# EAGLE design xmega breakout (EAGLE 7.1.0)
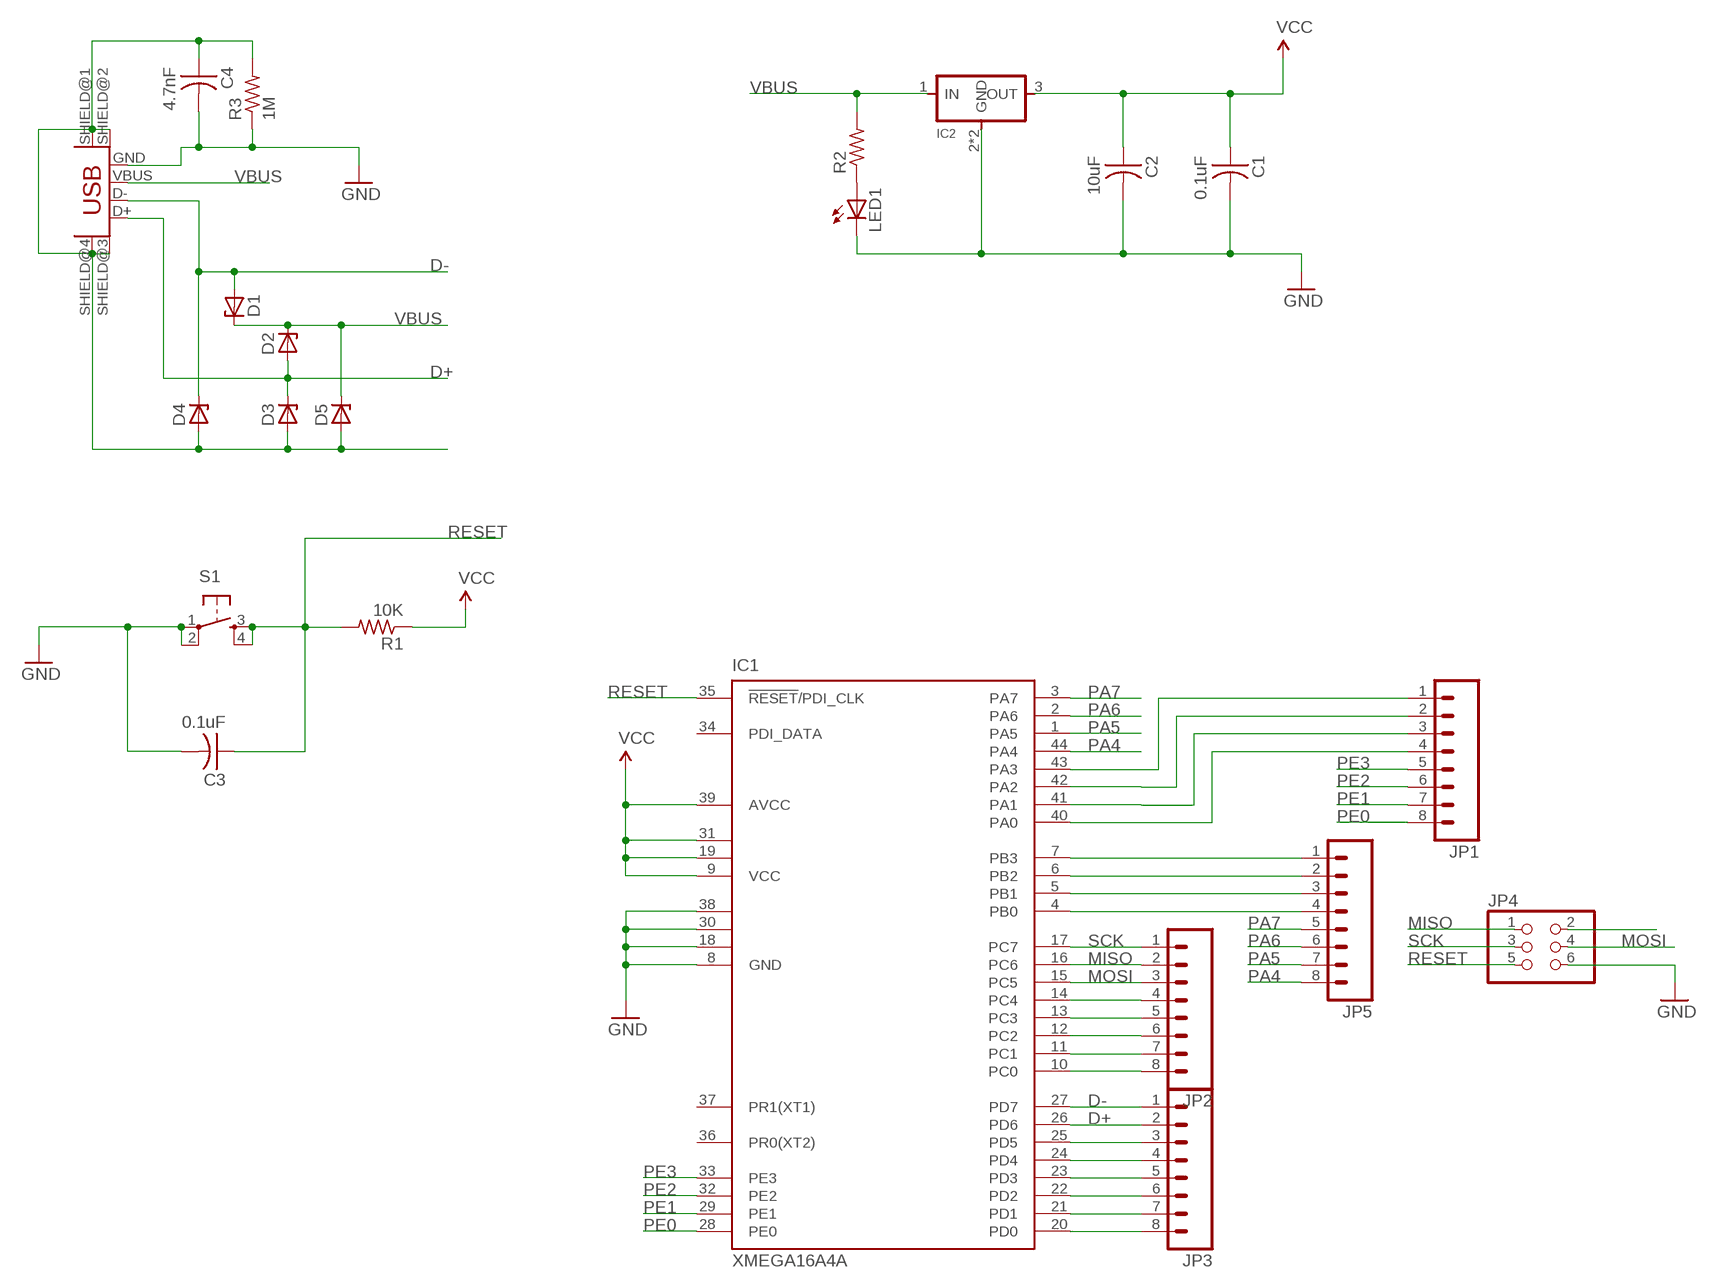
[diagram p0: schematic, sheet 1]

## Parts
C1  0.1uF  CAP-US1206  [C1206]
C2  10uF  CAP-US1206  [C1206]
C3  0.1uF  CAP-US1206  [C1206]
C4  4.7nF  CAP-US1206  [C1206]
D1  ZENER_DIODESOD123  [SOD123]
D2  ZENER_DIODESOD123  [SOD123]
D3  ZENER_DIODESOD123  [SOD123]
D4  ZENER_DIODESOD123  [SOD123]
D5  ZENER_DIODESOD123  [SOD123]
IC1  XMEGA16A4A  [TQFP44]
IC2  REGULATORSOT223  [SOT223]
JP1  M08  [1X08_SMD_ALT_2X1X4]
JP2  M08SMD-STRAIGHT-ALT  [1X08_SMD_ALT]
JP3  M08SMD-STRAIGHT-ALT  [1X08_SMD_ALT]
JP4  PINHD-2X3-SMD  [2X03SMD]
JP5  M08SMD-STRAIGHT-ALT  [1X08_SMD_ALT]
LED1  LEDSMT1206  [1206]
R1  10K  RES-US1206FAB  [R1206FAB]
R2  RES-US1206FAB  [R1206FAB]
R3  1M  RES-US1206FAB  [R1206FAB]
S1  6MM_SWITCH6MM_SWITCH  [6MM_SWITCH]
U$1  USB_MINIB  [USB_MINIB]

## Nets
D+: D2.ANODE D3.CATHODE IC1.26(PD6) JP3.2 U$1.D+
D-: D1.ANODE D4.CATHODE IC1.27(PD7) JP3.1 U$1.D-
GND: C1.2 C2.2 C3.2 C4.2 IC1.8(GND) IC1.18(GND1) IC1.30(GND2) IC1.38(GND3) IC2.2(GND) IC2.4(GND) JP4.6 LED1.C R3.1 S1.1(P) S1.2(P1) U$1.GND
MISO: IC1.16(PC6) JP2.2 JP4.1
MOSI: IC1.15(PC5) JP2.3 JP4.4
N$5: IC1.43(PA3) JP1.1
N$6: IC1.42(PA2) JP1.2
N$7: IC1.41(PA1) JP1.3
N$8: IC1.40(PA0) JP1.4
N$9: IC1.7(PB3) JP5.1
N$10: IC1.6(PB2) JP5.2
N$11: IC1.5(PB1) JP5.3
N$12: IC1.14(PC4) JP2.4
N$13: IC1.13(PC3) JP2.5
N$14: IC1.12(PC2) JP2.6
N$15: IC1.11(PC1) JP2.7
N$16: IC1.10(PC0) JP2.8
N$17: JP4.2
N$18: IC1.4(PB0) JP5.4
N$19: IC1.25(PD5) JP3.3
N$20: IC1.24(PD4) JP3.4
N$21: IC1.23(PD3) JP3.5
N$22: IC1.22(PD2) JP3.6
N$23: IC1.21(PD1) JP3.7
N$24: IC1.20(PD0) JP3.8
N$25: C4.1 D3.ANODE D4.ANODE D5.ANODE R3.2 U$1.SHIELD@1(SHIELD) U$1.SHIELD@2(SHIELD1) U$1.SHIELD@3(SHIELD2) U$1.SHIELD@4(SHIELD3)
N$26: LED1.A R2.1
PA4: IC1.44(PA4) JP5.8
PA5: IC1.1(PA5) JP5.7
PA6: IC1.2(PA6) JP5.6
PA7: IC1.3(PA7) JP5.5
PE0: IC1.28(PE0) JP1.8
PE1: IC1.29(PE1) JP1.7
PE2: IC1.32(PE2) JP1.6
PE3: IC1.33(PE3) JP1.5
RESET: C3.1 IC1.35(!RESET!/PDI_CLK) JP4.5 R1.2 S1.3(S) S1.4(S1)
SCK: IC1.17(PC7) JP2.1 JP4.3
VBUS: D1.CATHODE D2.CATHODE D5.CATHODE IC2.1(IN) R2.2 U$1.VBUS
VCC: C1.1 C2.1 IC1.9(VCC) IC1.19(VCC1) IC1.31(VCC2) IC1.39(AVCC) IC2.3(OUT) R1.1
Unconnected: IC1.34(PDI_DATA) IC1.36(PR0(XT2)) IC1.37(PR1(XT1))

## Library data of the parts
C1-C4 = fab:CAP-US
D1-D5 = fab:ZENER_DIODE: zener diode
IC1 = atmel:XMEGA16A4: MICROCONTROLLER Features High-performance, Low-power 8/16-bit AVR XMEGA Microcontroller Non-Volatile Program and Data Memories - 16 KB - 128 KB of In-System Self-Programmable Flash - 4 KB - 8 KB Boot Code Section with Independent Lock Bits - 1 KB - 2 KB EEPROM - 2 KB - 8 KB Internal SRAM Peripheral Features - Four-channel DMA Controller with support for external requests - Eight-channel Event System - Five 16-bit Timer/Counters Three Timer/Counters with 4 Output Compare or Input Capture channels Two Timer/Counters with 2 Output Compare or Input Capture channels High-Resolution Extensions on all Timer/Counters Advanced Waveform Extension on one Timer/Counter - Five USARTs IrDA Extension on one USART - Two Two-Wire Interfaces with dual address match (I2C and SMBus compatible) - Two SPIs (Serial Peripheral Interfaces) peripherals - AES and DES Crypto Engine - 16-bit Real Time Counter with Separate Oscillator - One Twelve-channel, 12-bit, 2 Msps Analog to Digital Converter - One Two-channel, 12-bit, 1 Msps Digital to Analog Converter - Two Analog Comparators with Window compare function - External Interrupts on all General Purpose I/O pins - Programmable Watchdog Timer with Separate On-chip Ultra Low Power Oscillator Special Microcontroller Features - Power-on Reset and Programmable Brown-out Detection - Internal and External Clock Options with PLL - Programmable Multi-level Interrupt Controller - Sleep Modes: Idle, Power-down, Standby, Power-save, Extended Standby - Advanced Programming, Test and Debugging Interfaces PDI (Program and Debug Interface) for programming, test and debugging I/O and Packages - 34 Programmable I/O Lines - 44 - lead TQFP - 44 - pad VQFN/QFN - 49 - ball VFBGA Operating Voltage - 1.6 - 3.6V Speed performance - 0 - 12 MHz @ 1.6 - 3.6V - 0 - 32 MHz @ 2.7 - 3.6V Drawn by Dipl.-Ing. (FH) Robert Siegler Created: 27.05.09; OC_FARNELL: unknown; OC_NEWARK: unknown
IC2 = fab:REGULATOR
JP1-JP3 JP5 = SparkFun:M08: Header 8 Standard 8-pin 0.1" header. Use with straight break away headers (SKU : PRT-00116), right angle break away headers (PRT-00553), swiss pins (PRT-00743), machine pins (PRT-00117), and female headers (PRT-00115).
JP4 = fab:PINHD-2X3-SMD: PIN HEADER
LED1 = adafruit:LED: LED OSRAM: - CHIPLED LG R971, LG N971, LY N971, LG Q971, LY Q971, LO R971, LY R971 LH N974, LH R974 LS Q976, LO Q976, LY Q976 LO Q996 - Hyper CHIPLED LW Q18S LB Q993, LB Q99A, LB R99A - SideLED LS A670, LO A670, LY A670, LG A670, LP A670 LB A673, LV A673, LT A673, LW A673 LH A674 LY A675 LS A676, LA A676, LO A676, LY A676, LW A676 LS A679, LY A679, LG A679 - Hyper Micro SIDELED® LS Y876, LA Y876, LO Y876, LY Y876 LT Y87S - SmartLED LW L88C, LW L88S LB L89C, LB L89S, LG L890 LS L89K, LO L89K, LY L89K LS L896, LA L896, LO L896, LY L896 - TOPLED LS T670, LO T670, LY T670, LG T670, LP T670 LSG T670, LSP T670, LSY T670, LOP T670, LYG T670 LG T671, LOG T671, LSG T671 LB T673, LV T673, LT T673, LW T673 LH T674 LS T676, LA T676, LO T676, LY T676, LB T676, LH T676, LSB T676, LW T676 LB T67C, LV T67C, LT T67C, LS T67K, LO T67K, LY T67K, LW E67C LS E67B, LA E67B, LO E67B, LY E67B, LB E67C, LV E67C, LT E67C LW T67C LS T679, LY T679, LG T679 LS T770, LO T770, LY T770, LG T770, LP T770 LB T773, LV T773, LT T773, LW T773 LH T774 LS E675, LA E675, LY E675, LS T675 LS T776, LA T776, LO T776, LY T776, LB T776 LHGB T686 LT T68C, LB T68C - Hyper Mini TOPLED® LB M676 - Mini TOPLED Santana® LG M470 LS M47K, LO M47K, LY M47K Source: http://www.osram.convergy.de/
R1-R3 = fab:RES-US: Resistor (US Symbol) Variants with postfix FAB are widened to allow the routing of internal traces
S1 = fab:6MM_SWITCH: OMRON SWITCH
U$1 = fab:USB_MINIB

## Board
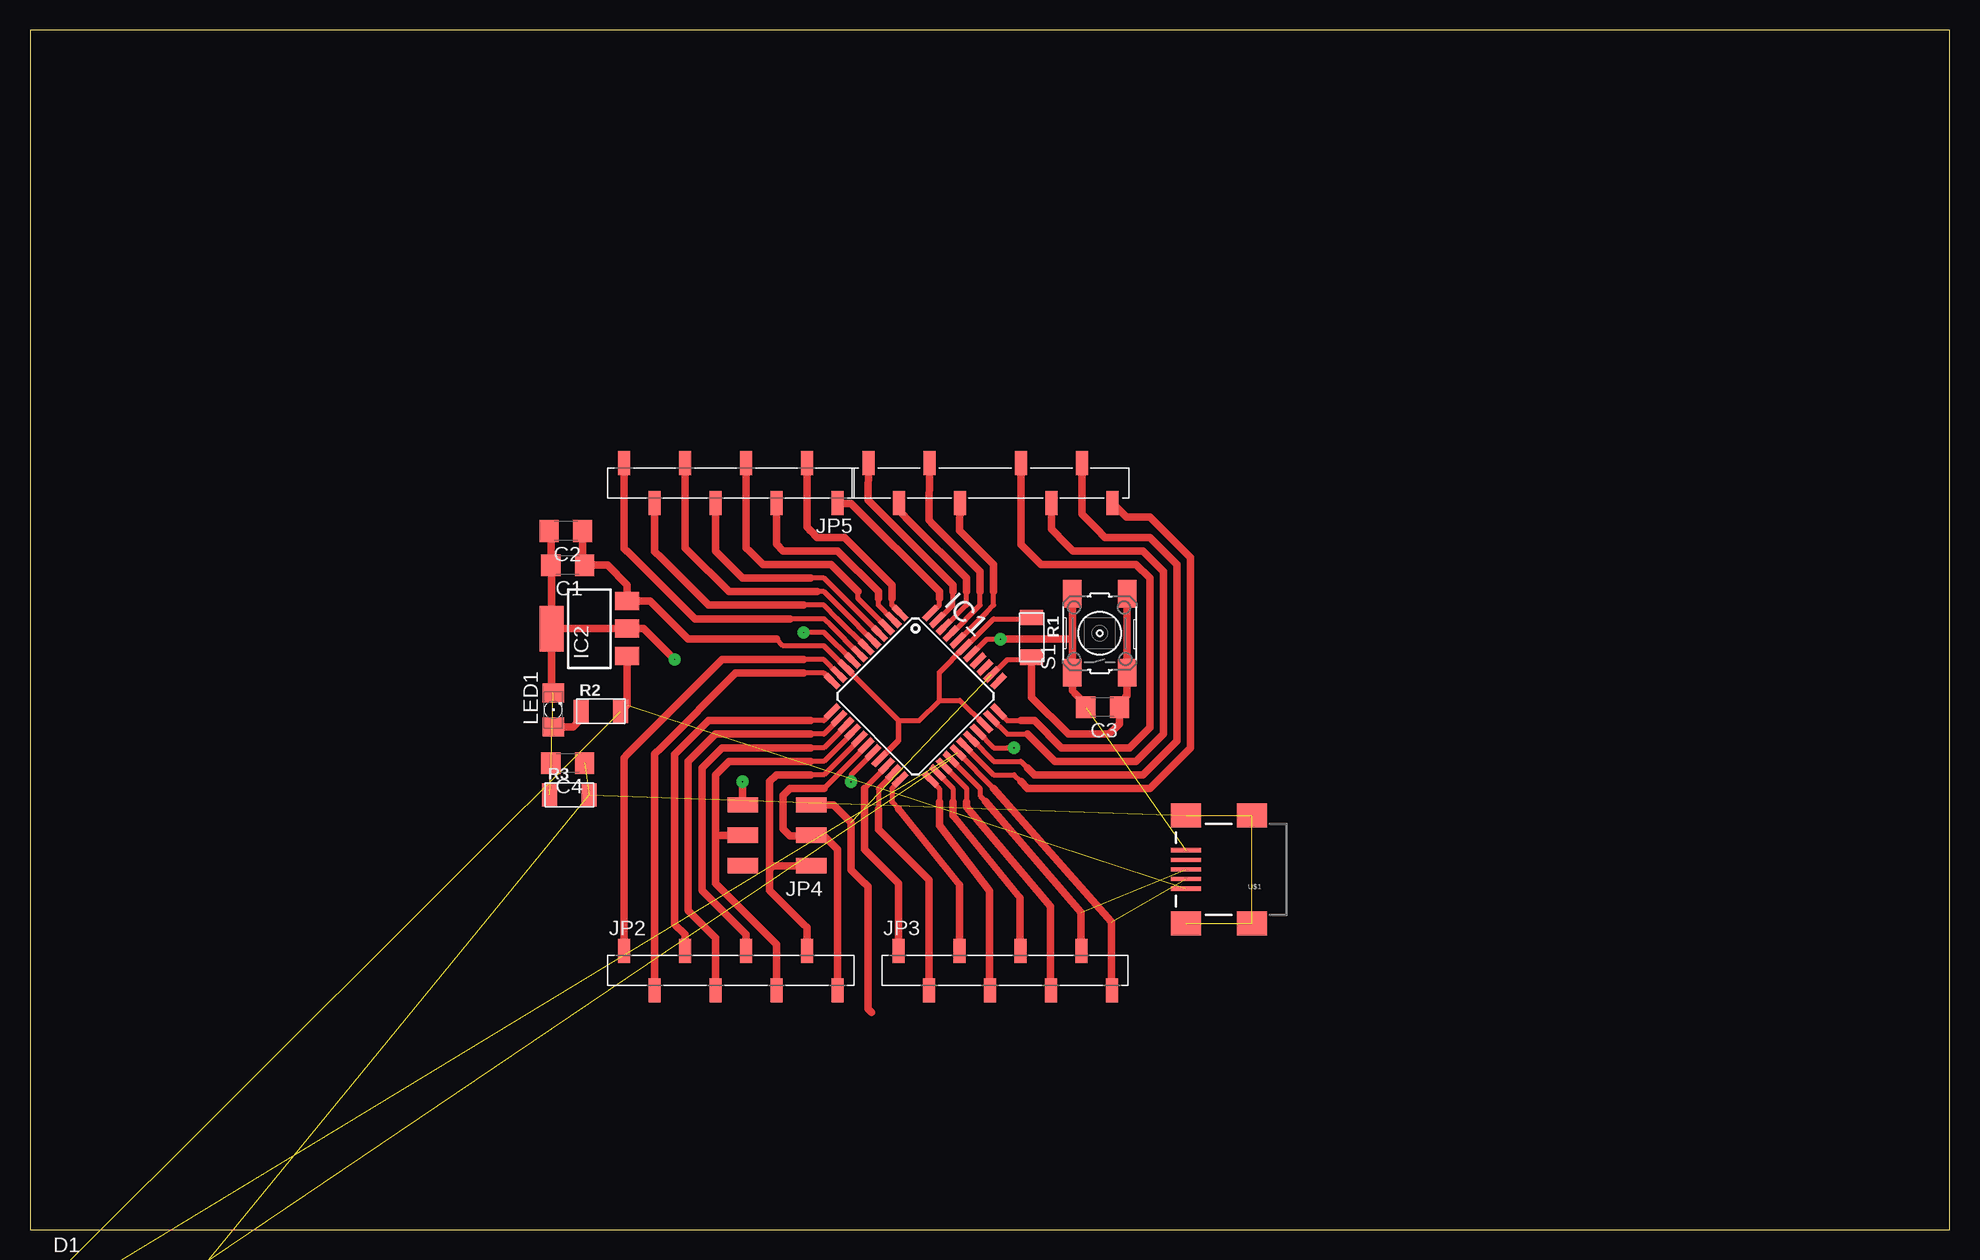
[diagram p1: board, top side]
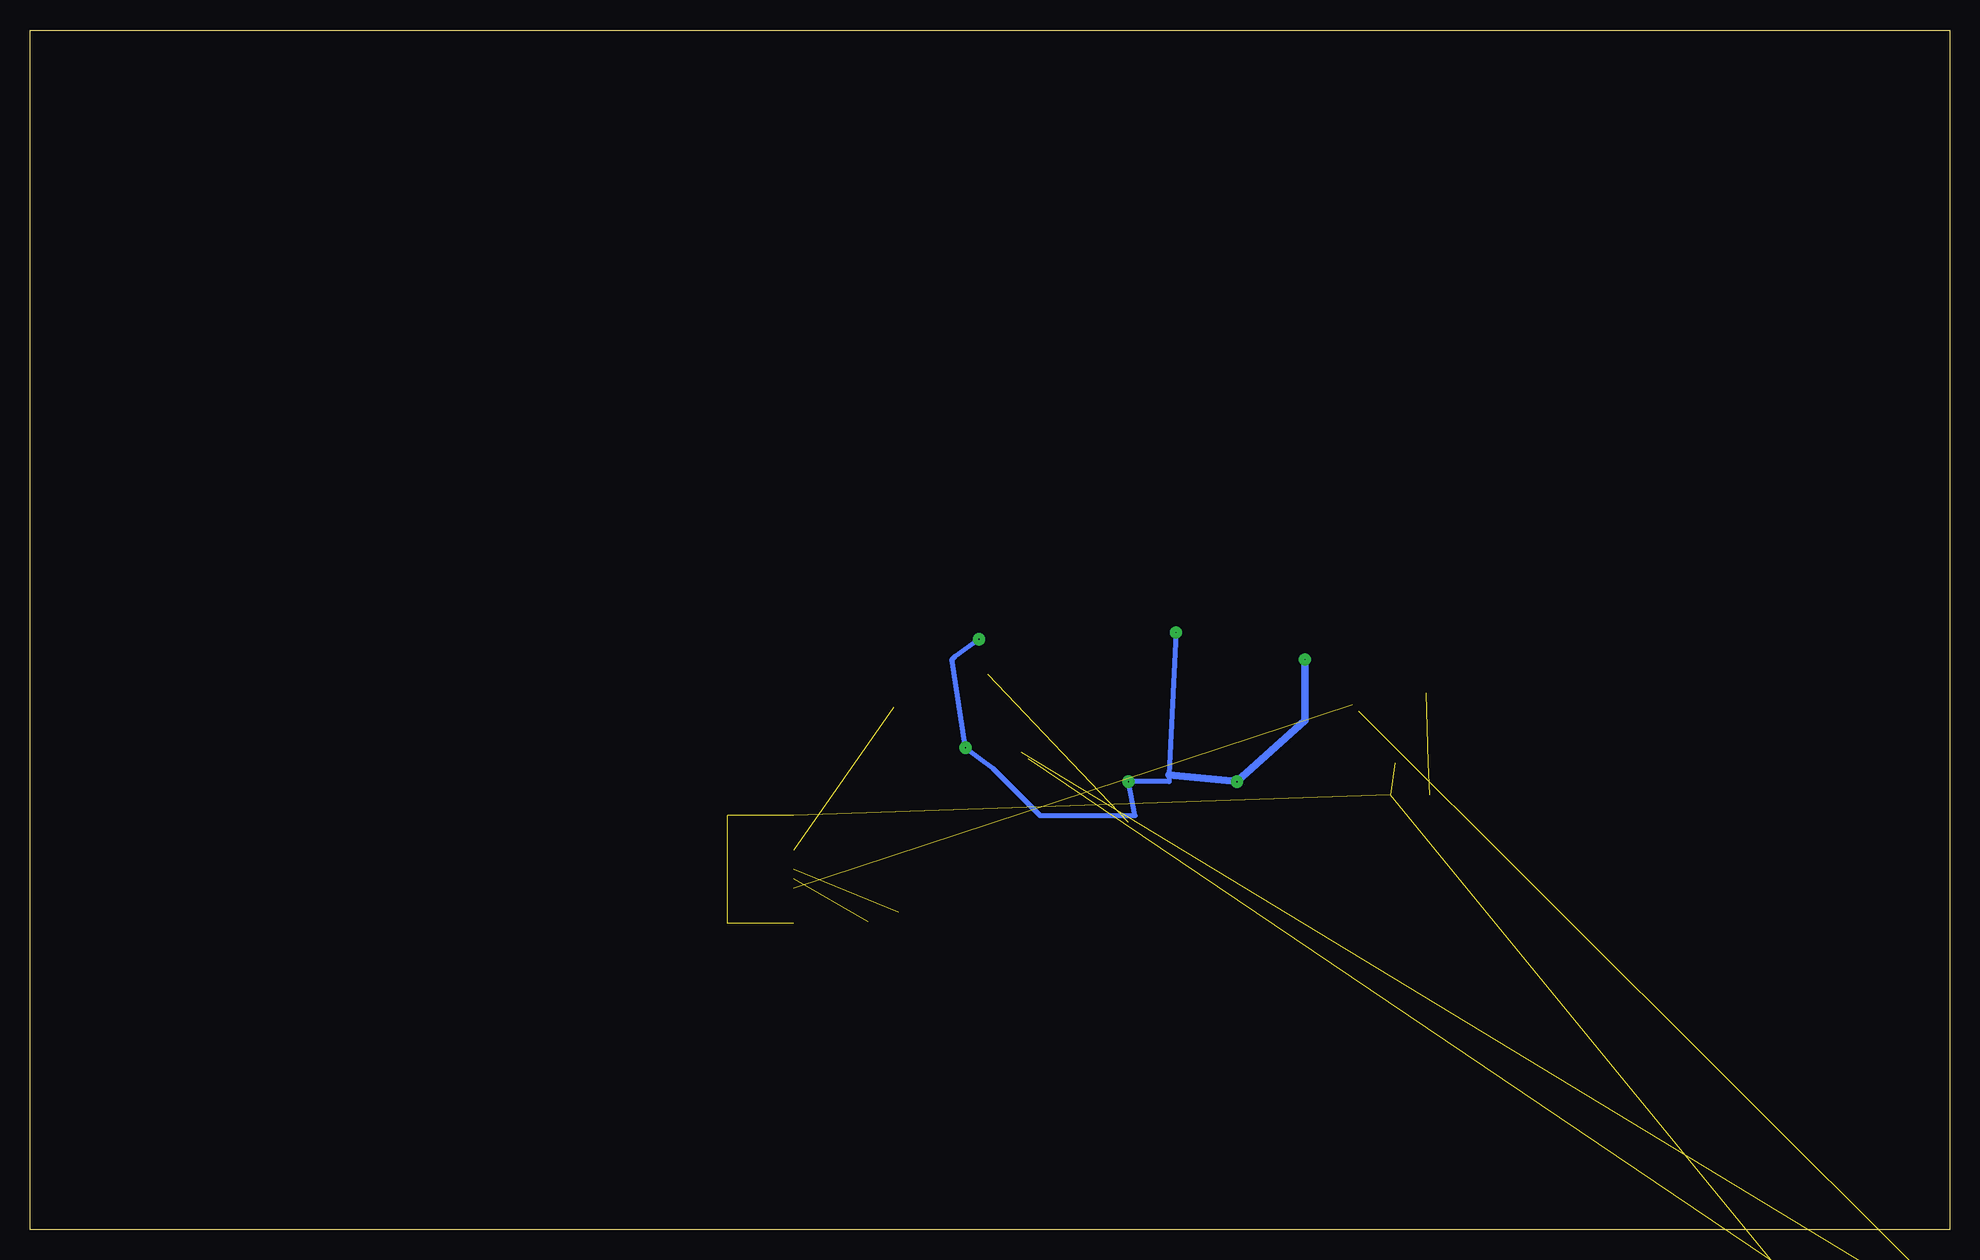
[diagram p2: board, bottom side, seen from below]

Size 160 x 100 mm. Coordinates in mm from the lower left corner, seen from the top.
Outline: 0,0 160,0 160,100 0,100 0,0
Copper layers (1*16): Top 0.035mm / dielectric 1.5mm / Bottom 0.035mm
Design rules "default": minimum track width 10mil, minimum drill 24mil, track to track 8mil, track to pad 8mil, pad to pad 8mil, via to via 8mil, smd to smd 8mil, copper to edge 40mil, drill to drill 8mil, minimum pad ring 10mil, minimum via ring 8mil, stop-mask expansion 4mil, vias tented up to drill 0mil, thermal gap 10mil

### Footprints (pad centres in the part's own frame; a part is rotated, then mirrored left to right if it is on the bottom)
C1206 = smd 1.6 x 1.8: 1 -1.4,0; 2 1.4,0
SOD123 = smd 1.6 x 0.8: ANODE 1.7,0; CATHODE -1.7,0
TQFP44 = smd 1.5 x 0.5: 1 -5.8,4; 2 -5.8,3.2; 3 -5.8,2.4; 4 -5.8,1.6; 5 -5.8,0.8; 6 -5.8,0; 7 -5.8,-0.8; 8 -5.8,-1.6; 9 -5.8,-2.4; 10 -5.8,-3.2; 11 -5.8,-4; 23 5.8,-4; 24 5.8,-3.2; 25 5.8,-2.4; 26 5.8,-1.6; 27 5.8,-0.8; 28 5.8,0; 29 5.8,0.8; 30 5.8,1.6; 31 5.8,2.4; 32 5.8,3.2; 33 5.8,4 | smd 0.5 x 1.5: 12 -4,-5.8; 13 -3.2,-5.8; 14 -2.4,-5.8; 15 -1.6,-5.8; 16 -0.8,-5.8; 17 0,-5.8; 18 0.8,-5.8; 19 1.6,-5.8; 20 2.4,-5.8; 21 3.2,-5.8; 22 4,-5.8; 34 4,5.8; 35 3.2,5.8; 36 2.4,5.8; 37 1.6,5.8; 38 0.8,5.8; 39 0,5.8; 40 -0.8,5.8; 41 -1.6,5.8; 42 -2.4,5.8; 43 -3.2,5.8; 44 -4,5.8
SOT223 = smd 1.5 x 2: 1 -2.3,-3.15; 2 0,-3.15; 3 2.3,-3.15 | smd 3.8 x 2: 4 0,3.15
1X08_SMD_ALT_2X1X4 = smd 1 x 2: 1 20.32,-1.65; 2 17.78,1.65; 3 15.24,-1.65; 4 12.7,1.65; 5 7.62,-1.65; 6 5.08,1.65; 7 2.54,-1.65; 8 0,1.65
1X08_SMD_ALT = smd 1 x 2: 1 0,-1.65; 2 -2.54,1.65; 3 -5.08,-1.65; 4 -7.62,1.65; 5 -10.16,-1.65; 6 -12.7,1.65; 7 -15.24,-1.65; 8 -17.78,1.65
2X03SMD = smd 2.54 x 1.27: 1 -2.857,2.54; 2 2.857,2.54; 3 -2.857,0; 4 2.857,0; 5 -2.857,-2.54; 6 2.857,-2.54
1206 = smd 1.6 x 1.803: A -1.422,0; C 1.422,0
R1206FAB = smd 1.27 x 1.905: 1 -1.651,0; 2 1.651,0
6MM_SWITCH = smd 2.286 x 1.524: 1 -3.302,2.286; 2 3.302,2.286; 3 -3.302,-2.286; 4 3.302,-2.286
USB_MINIB = smd 2.5 x 0.35: D+ 3.77,0; D- 3.77,0.8; GND 3.77,-1.6; ID 3.77,-0.8; VBUS 3.77,1.6 | smd 2.5 x 2: SHIELD@1 -1.73,-4.5; SHIELD@2 -1.73,4.5; SHIELD@3 3.77,4.5; SHIELD@4 3.77,-4.5

### Placement (x,y rotation side)
C1  44.82,55.38 180 top
C2  44.67,58.23 180 top
C3  89.41,43.54 180 top
C4  44.82,38.88 180 top
D1  3.81,-3.81 0 top  (outside the outline)
D2  3.81,-8.89 0 top  (outside the outline)
D3  3.81,-13.97 0 top  (outside the outline)
D4  3.81,-19.05 0 top  (outside the outline)
D5  3.81,-24.13 0 top  (outside the outline)
IC1  73.8,44.45 315 top
IC2  46.61,50.1 90 top
JP1  90.21,62.23 180 top
JP2  67.31,21.59 0 top
JP3  90.17,21.59 0 top
JP4  62.25,32.87 180 top
JP5  49.53,62.23 180 top
LED1  43.62,43.32 90 top
R1  83.48,49.37 270 top
R2  47.58,43.2 0 top
R3  44.96,36.23 0 top
S1  89.17,49.71 90 top
U$1  100.11,30.02 180 top

### Tracks (layer width: path | path; a pad name or v marks a point on that pad's centre or on a via)
D+  (3 unrouted)
  Top 0.406: IC1.26 76.77,39.2 79.2,36.77 79.2,36.15 79.66,35.69
  Top 0.61: 79.66,35.69 87.62,26.45 JP3.2
D-  (3 unrouted)
  Top 0.406: IC1.27 77.34,39.76 80.33,36.77
  Top 0.61: 80.33,36.77 80.33,36.76 90.17,25.65 JP3.1
GND  (via drill 0.1 pad 1.02)  (3 unrouted)
  Top 0.406: IC1.8 68.55,47.42 66.19,49.78 v64.49,49.78 | IC1.38 78.53,47.99 | 78.53,47.99 | 78.53,47.99 79.76,49.22 v80.89,49.22 | IC1.18 70.26,39.72 68.45,37.9 v68.45,37.34 | IC1.30 79.03,41.46 80.33,40.16 81.46,40.16 | 81.46,40.16 | 81.46,40.16 v82.02,40.16
  Top 0.61: JP4.6 59.4,36.77 v59.4,37.34 | IC2.4 IC2.2 51.16,50.1 52.61,48.65 v53.74,47.52 | IC2.4 43.46,55.34 C1.2 43.42,58.08 C2.2 | v80.89,49.22 80.91,49.23 86.86,49.23 86.88,49.22 | 86.88,49.22 S1.1 86.88,44.92 87.12,44.69 88.01,43.8 C3.2 | 86.88,49.22 S1.2 | IC2.4 43.46,44.9 LED1.C
  Bottom 0.406: v64.49,49.78 65.05,37.9 65.05,37.34 v68.45,37.34 67.88,34.51 75.8,34.51 79.76,38.47 v82.02,40.16 83.16,47.52 82.87,47.8 v80.89,49.22
  Bottom 0.61: 65.05,37.9 v59.4,37.34 53.74,42.43 v53.74,47.52
MISO
  Top 0.406: IC1.16 69.13,40.85 66.19,37.9 65.05,37.9
  Top 0.61: 65.05,37.9 63.36,37.9 62.23,37.9 61.66,37.34 61.66,36.2 61.66,29.98 | 61.66,29.98 61.66,28.28 64.49,25.46 64.77,25.17 JP2.2 | JP4.1 61.88,30.33 61.66,29.98
MOSI
  Top 0.406: IC1.15 68.57,41.41 66.19,39.03 | 66.19,39.03 65.05,39.03 66.19,39.03
  Top 0.61: 65.05,39.03 58.27,39.03 57.13,37.9 57.13,32.81 | 57.13,32.81 57.13,29.42 57.13,28.85 62.23,23.75 JP2.3 | JP4.4 57.19,32.87 57.13,32.81
N$5
  Top 0.406: IC1.43 75.7,50.81 76.93,52.04 76.93,53.17
  Top 0.61: 76.93,53.17 76.93,53.74 70.14,60.53 69.85,60.82 JP1.1
N$6
  Top 0.406: IC1.42 76.27,50.25 78.06,52.04 78.06,53.17
  Top 0.61: 78.06,53.17 78.06,54.31 73.54,58.83 72.41,59.96 72.41,60.56 JP1.2
N$7
  Top 0.406: IC1.41 76.83,49.68 79.2,52.04 79.2,53.17
  Top 0.61: 79.2,53.17 79.2,54.87 75.24,58.83 74.93,59.14 JP1.3
N$8
  Top 0.406: IC1.40 77.4,49.12 79.76,51.48 | 79.76,51.48 | 79.76,51.48 80.33,52.04 80.33,53.17
  Top 0.61: 80.33,53.17 80.33,55.44 77.5,58.27 77.47,58.29 JP1.4
N$9
  Top 0.406: IC1.7 69.11,47.99 66.75,50.35 66.19,50.91 63.36,50.91
  Top 0.61: 63.36,50.91 55.44,50.91 49.78,56.57 49.74,56.57 49.54,56.77 JP5.1
N$10
  Top 0.406: IC1.6 69.68,48.55 67.32,50.91 | 67.32,50.91 | 67.32,50.91 66.19,52.04 64.49,52.04
  Top 0.61: 64.49,52.04 56.57,52.04 52.61,56 52.59,56 52.06,56.53 52.06,60.57 JP5.2
N$11
  Top 0.406: IC1.5 70.24,49.12 67.88,51.48 66.19,53.17 65.62,53.17
  Top 0.61: 65.62,53.17 58.27,53.17 54.87,56.57 54.84,56.57 54.6,56.8 JP5.3
N$12
  Top 0.406: IC1.14 68,41.98 66.19,40.16 65.05,40.16
  Top 0.61: 65.05,40.16 57.7,40.16 56,38.47 56,28.85 56,28.28 57.7,26.59 59.69,24.6 JP2.4
N$13
  Top 0.406: IC1.13 67.44,42.55 66.19,41.3 65.05,41.3
  Top 0.61: 65.05,41.3 57.13,41.3 54.87,39.03 54.87,28.28 | 54.87,28.28 54.87,27.72 | JP2.5 57.15,24.31 55.44,26.02 54.87,26.59 54.87,28.28
N$14
  Top 0.406: IC1.12 66.87,43.11 66.19,42.43 65.05,42.43
  Top 0.61: 65.05,42.43 56.57,42.43 53.74,39.6 53.74,25.46 54.61,24.59 JP2.6 | JP2.6
N$15
  Top 0.406: IC1.11 66.85,45.72 66.19,46.39 64.49,46.39
  Top 0.61: 64.49,46.39 58.83,46.39 52.61,40.16 | 52.61,40.16 | 52.61,40.16 52.6,40.16 52.08,39.64 JP2.7
N$16
  Top 0.406: IC1.10 67.41,46.29 66.19,47.52 64.49,47.52
  Top 0.61: 64.49,47.52 57.7,47.52 49.78,39.6 49.78,39.59 49.52,39.33 49.52,23.25 JP2.8
N$18
  Top 0.406: IC1.4 70.81,49.68 68.45,52.04 67.32,53.17 | 67.32,53.17 | 67.32,53.17 66.19,54.31 65.05,54.31
  Top 0.61: 65.05,54.31 59.4,54.31 57.13,56.57 57.13,58.02 JP5.4
N$19
  Top 0.406: IC1.25 76.2,38.63 78.06,36.77 78.06,35.64
  Top 0.61: 78.06,35.64 78.06,35.23 85.08,26.95 JP3.3
N$20
  Top 0.406: IC1.24 75.64,38.06 76.93,36.77 76.93,35.64
  Top 0.61: 76.93,35.64 76.93,34.5 82.54,27.63 82.54,23.25 JP3.4
N$21
  Top 0.406: IC1.23 75.07,37.5 75.8,36.77 75.8,35.64
  Top 0.61: 75.8,35.64 75.8,33.7 80,28.24 80,19.95 JP3.5
N$22
  Top 0.406: IC1.22 72.53,37.45 71.84,36.77 71.84,35.64 | 71.84,35.64 | 71.84,35.64 72.41,35.07
  Top 0.61: 72.41,35.07 72.41,35.06 77.48,28.72 JP3.6
N$23
  Top 0.406: IC1.21 71.96,38.02 70.71,36.77 70.71,35.07
  Top 0.61: 70.71,35.07 70.71,33.36 74.93,29.13 JP3.7
N$24
  Top 0.406: IC1.20 71.4,38.59 69.58,36.77 69.58,36.76
  Top 0.61: 69.58,36.77 69.58,31.68 72.41,28.85 72.39,28.83 JP3.8
N$25  (8 unrouted)
N$26
  Top 0.61: LED1.A 45.29,41.9 45.82,42.43 45.82,43.1 R2.1
PA4
  Top 0.406: IC1.44 75.14,51.38 75.8,52.04 75.8,52.61
  Top 0.61: 67.36,60.53 JP5.8 67.36,60.53 | 75.8,52.61 75.8,53.17 68.45,60.53 67.36,60.53
PA5
  Top 0.406: IC1.1 72.5,51.38 71.84,52.04 71.84,52.61
  Top 0.61: 71.84,52.61 71.84,53.74 67.88,57.7 65.62,57.7 65.05,58.27 | 65.05,58.27 65.03,58.27 | 65.05,58.27 64.78,58.55 JP5.7
PA6
  Top 0.406: IC1.2 71.94,50.81 70.71,52.04 70.71,52.61
  Top 0.61: 70.71,52.61 70.71,53.17 67.32,56.57 62.79,56.57 62.79,56.58 62.24,57.13 JP5.6
PA7
  Top 0.406: IC1.3 71.26,50.37 70.14,51.48 | 70.14,51.48 | 70.14,51.48 69.58,52.04 | 69.58,52.04 | 69.58,52.04 69.01,52.61 69.01,53.17
  Top 0.61: 69.01,53.17 66.75,55.44 61.09,55.44 59.96,56.57 59.69,56.83 JP5.5
PE0
  Top 0.406: IC1.28 77.9,40.33 80.33,37.9 82.02,37.9 82.59,37.34
  Top 0.61: 82.59,37.34 | 82.59,37.34 83.16,36.77 93.34,36.77 96.73,40.16 96.73,56 93.34,59.4 91.4,59.4 JP1.8
PE1
  Top 0.406: IC1.29 78.47,40.89 | 78.47,40.89 | 78.47,40.89 80.33,39.03 82.59,39.03 83.16,38.47
  Top 0.61: 83.16,38.47 | 83.16,38.47 83.72,37.9 92.77,37.9 95.6,40.73 95.6,55.44 93.34,57.7 89.62,57.7 88.9,58.42 87.67,59.65 JP1.7
PE2
  Top 0.406: 80.16,42.59 IC1.32 80.16,42.59 | 80.16,42.59 81.46,41.3 | 81.46,41.3 82.59,41.3 | 80.16,42.59 81.46,41.3 | 81.46,41.3 83.16,41.3
  Top 0.61: 83.16,41.3 | 83.16,41.3 85.42,39.03 92.21,39.03 94.47,41.3 94.47,54.87 92.77,56.57 86.94,56.57 86.36,57.15 85.14,58.38 JP1.6
PE3
  Top 0.406: 80.73,43.16 IC1.33 80.73,43.16 | 80.73,43.16 81.46,42.43 | 81.46,42.43 82.59,42.43 81.46,42.43 | 80.73,43.16 81.46,42.43
  Top 0.61: 82.59,42.43 83.72,42.43 85.98,40.16 91.64,40.16 93.34,41.86 93.34,54.31 92.21,55.44 84.26,55.44 83.82,55.88 82.59,57.1 JP1.5
RESET  (1 unrouted)
  Top 0.406: IC1.35 80.23,46.29 81.46,47.52 83.29,47.52 R1.2
  Top 0.61: S1.4 S1.3 91.45,44.5 91.08,44.12 91.08,43.81 C3.1 90.81,42.16 90.51,41.86 89.94,41.3 86.55,41.3 83.48,44.36 83.48,46.06 R1.2 | JP4.5 66.98,35.41 68.45,33.94 68.45,29.98 69.58,28.85 69.59,28.85 69.84,28.6 69.84,18.69 69.84,18.41 70.14,18.1
SCK
  Top 0.406: IC1.17 69.7,40.28 66.75,37.34 66.19,36.77
  Top 0.61: 66.19,36.77 63.92,36.77 63.36,36.77 | 65.06,32.81 63.36,32.81 62.79,33.38 62.79,35.64 62.79,36.2 63.36,36.77 | 65.06,32.81 JP4.3 | 65.06,32.81 66.19,32.81 67.32,31.68 JP2.1 | 63.36,36.77
VBUS  (4 unrouted)
  Top 0.61: IC2.1 49.76,43.74 R2.2
VCC
  Top 0.406: IC1.9 67.98,46.85 | IC1.19 70.83,39.15 | IC1.9 68,46.83 72.41,42.43 | 72.41,42.43 72.41,40.8 IC1.19 | IC1.19 70.9,39.22 72.41,40.73 72.41,42.43 | 72.41,42.43 74.11,42.43 75.8,44.12 | 75.8,44.12 75.8,46.45 IC1.39 77.97,48.55 80.33,50.91 83.38,50.91 R1.1 | 75.8,44.12 77.5,44.12 77.52,44.12 IC1.31 | 70.83,39.15 | 70.83,39.15 70.71,39.03 | IC1.9 67.98,46.85 | IC1.9 67.98,46.85 | 67.98,46.85 66.19,48.65 62.79,48.65 62.23,49.22
  Top 0.61: C2.1 46.07,55.53 C1.1 48.14,55.38 49.78,53.74 49.78,52.41 IC2.3 51.69,52.4 54.87,49.22 62.23,49.22